# EasyEDA Pro project ZeptoWatch.eprj, board PCB5
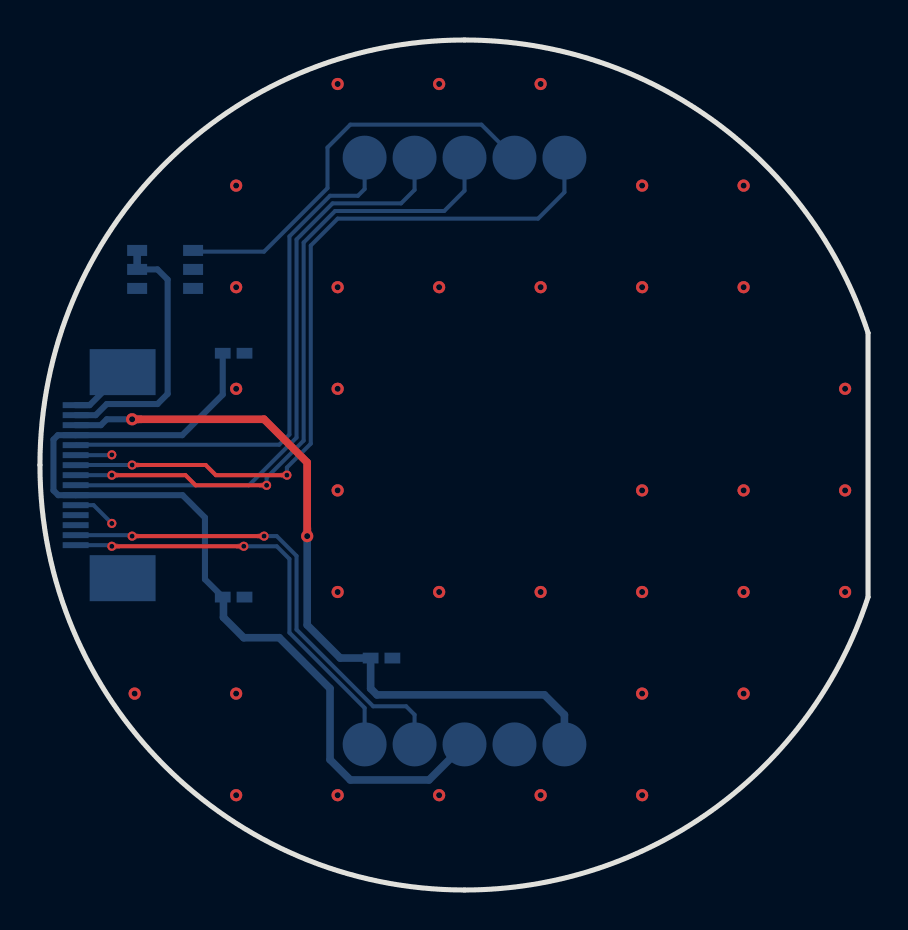
[diagram p14: board, top side]
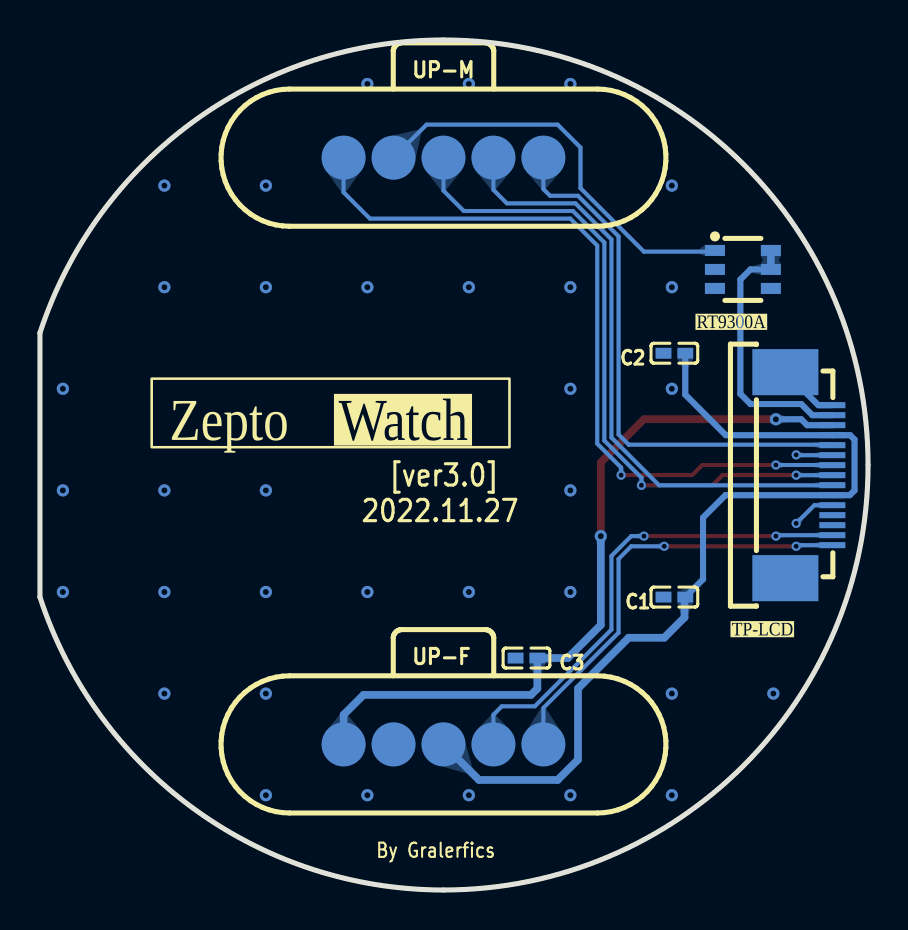
[diagram p15: board, bottom side, seen from below]

Outline 41.45 x 42.5 mm; copper layers: Top Layer, Bottom Layer. Coordinates in mm from the lower left corner of the outline.
Outline path: 0,21.25 arc(6.22,36.28) 21.25,42.5 arc(33.72,38.45) 41.45,27.86 41.45,14.64 arc(33.72,4.05) 21.25,0 arc(6.22,6.22) 0,21.25
Stack: Top Layer 0.035mm / Dielectric1 1.51mm FR4 er 4.5 / Bottom Layer 0.035mm

## Design rules (mm)
spacing safeClearance (default): track to track 0.152, other pairs 0 to 0.152
track width trackWidth (default): min 0.127, default 0.254, max 2.54
differential pair differentialPair (default): width min 0.127, default 0.254, max 2.54; gap min 0.152, default 0.152
via viaSize (default): diameter min 0.381, default 0.457, max 10; hole min 0.203, default 0.254, max 5.999

## Placement (name value [footprint] x y rotation side)
 RT9300A   -  [SOT-23-6_L2.9-W1.6-P0.95-LS2.8-BR]  6.26 31.03 0 bottom
 TP-LCD   -  [FFC-SMD_15P-P0.50_X05B20U15T]  2.96 20.74 270 bottom
C1  100nF  [C0402]  9.69 14.65 0 bottom
C2  100nF  [C0402]  9.69 26.84 0 bottom
C3  100nF  [C0402]  17.1 11.6 0 bottom
UP-F  -  [pogo-5pin-f]  21.25 7.28 0 bottom
UP-M  -  [pogo-5pin-m]  21.25 36.62 0 bottom

## Footprints (pads in the part's own frame, mm; a bottom-side part is the same pattern mirrored in y, then rotated)
C0402
  rect 0.79x0.54 smd: 1(-0.545,0) 2(0.545,0)
FFC-SMD_15P-P0.50_X05B20U15T
  rect 0.299x1.3 smd: 1(-3.5,1.176) 2(-2.999,1.176) 3(-2.499,1.176) 4(-1.999,1.176) 5(-1.501,1.176) 6(-1.001,1.176) 7(-0.5,1.176) 8(0,1.176) 9(0.5,1.176) 10(1.001,1.176) 11(1.501,1.176) 12(1.999,1.176) 13(2.499,1.176) 14(2.999,1.176) 15(3.5,1.176)
  rect 2.301x3.3 smd: 16(5.151,-1.176) 17(-5.151,-1.176)
pogo-5pin-f
  round 2.2 smd: 1(5,0) 2(2.5,0) 3(0,0) 4(-2.5,0) 5(-5,0)
pogo-5pin-m
  round 2.2 smd: 1(-5,0) 2(-2.5,0) 3(0,0) 4(2.5,0) 5(5,0)
SOT-23-6_L2.9-W1.6-P0.95-LS2.8-BR
  rect 1x0.55 smd: 1(1.4,-0.95) 2(1.4,0) 3(1.4,0.95) 4(-1.4,0.95) 5(-1.4,0) 6(-1.4,-0.95)

## Nets
GND:  RT9300A .2  TP-LCD .1  TP-LCD .6  TP-LCD .11  TP-LCD .16  TP-LCD .17 C1.2 C2.2 C3.2 UP-F.2
VBAT:  TP-LCD .3 C3.1 UP-F.1
VCC_3V3:  TP-LCD .4  TP-LCD .10 C1.1 C2.1 UP-F.3
LCD_BLK:  RT9300A .1 UP-M.4
LCD_DC:  TP-LCD .5 UP-M.1
LCD_LEDK:  RT9300A .5  RT9300A .6  TP-LCD .2
LCD_RST:  TP-LCD .9 UP-M.2
LCD_SCL:  TP-LCD .7 UP-M.5
LCD_SDA:  TP-LCD .8 UP-M.3
TP_SCL:  TP-LCD .15 UP-F.5
TP_SDA:  TP-LCD .14 UP-F.4

Pads without a net:  RT9300A  3 4;  TP-LCD  12 13

## Via types
v1: diameter 0.61, hole 0.305, Top Layer to Bottom Layer, 36 vias
v2: diameter 0.457, hole 0.254, Top Layer to Bottom Layer, 10 vias

## Routing (per net, layer and track width the routed paths; a pad name or vN(x,y) marks a point on that pad's centre or on a via; arc(x,y) is an arc through that point)
GND: length 7
  Bottom Layer w0.203: v2(3.6,21.76) 3.58,21.74 1.79,21.74 ; v2(3.6,18.33) 2.69,19.24  TP-LCD .11
  Bottom Layer w0.305:  TP-LCD .1 2.49,24.24  TP-LCD .17
  vias: v1(4.74,9.82) v1(9.82,35.22) v1(9.82,30.14) v1(9.82,25.06) v1(9.82,9.82) v1(9.82,4.74) v1(14.9,40.3) v1(14.9,30.14) v1(14.9,25.06) v1(14.9,19.98) v1(14.9,14.9) v1(14.9,4.74) v1(19.98,40.3) v1(19.98,30.14) v1(19.98,14.9) v1(19.98,4.74) v1(25.06,40.3) v1(25.06,30.14) v1(25.06,14.9) v1(25.06,4.74) v1(30.14,35.22) v1(30.14,30.14) v1(30.14,19.98) v1(30.14,14.9) v1(30.14,9.82) v1(30.14,4.74) v1(35.22,35.22) v1(35.22,30.14) v1(35.22,19.98) v1(35.22,14.9) v1(35.22,9.82) v1(40.3,25.06) v1(40.3,19.98) v1(40.3,14.9)
VBAT: length 37.8
  Top Layer w0.381: v1(13.38,17.69) 13.38,21.38 11.22,23.54 v1(4.61,23.54)
  Bottom Layer w0.305:  TP-LCD .3 3.05,23.24 3.34,23.54 v1(4.61,23.54)
  Bottom Layer w0.381: UP-F.1 26.25,8.76 25.25,9.76 16.87,9.76 16.55,10.07 16.55,11.6 15.03,11.6 13.38,13.25 v1(13.38,17.69)
VCC_3V3: length 45.8
  Bottom Layer w0.305: C2.1 9.15,24.77 7.12,22.74  TP-LCD .4 0.9,22.74 0.68,22.52 0.68,19.98 0.91,19.74  TP-LCD .10 7.14,19.74 8.26,18.62 8.26,15.53 C1.1
  Bottom Layer w0.381: UP-F.3 19.47,5.5 15.53,5.5 14.52,6.52 14.52,10.07 11.98,12.61 10.2,12.61 9.19,13.63 9.19,14.61 C1.1
LCD_BLK: length 20.6
  Bottom Layer w0.203: UP-M.4 22.1,38.27 15.53,38.27 14.39,37.12 14.39,35.09 11.22,31.92 7.72,31.92  RT9300A .1
LCD_DC: length 27.1
  Bottom Layer w0.203: UP-M.1 16.25,35.05 15.92,34.71 14.52,34.71 12.49,32.68 12.49,22.77 11.98,22.27 1.81,22.27 1.79,22.24
LCD_LEDK: length 13.4
  Bottom Layer w0.305:  TP-LCD .2 2.79,23.74 3.34,24.3 5.88,24.3 6.39,24.81 6.39,30.52 5.88,31.03  RT9300A .5
  Bottom Layer w0.381:  RT9300A .6  RT9300A .5
LCD_RST: length 30.5
  Bottom Layer w0.203:  TP-LCD .9 1.79,20.23 10.46,20.23 12.84,22.62 12.84,32.53 14.65,34.33 18.07,34.33 18.75,35.01 UP-M.2
LCD_SCL: length 38.3
  Top Layer w0.203: v2(4.61,21.25) 8.3,21.25 8.8,20.74 v2(12.36,20.74)
  Bottom Layer w0.203: v2(4.61,21.25) 1.79,21.25  TP-LCD .7 ; UP-M.5 26.25,34.89 24.93,33.57 14.9,33.57 13.55,32.22 13.55,22.32 12.36,21.12 v2(12.36,20.74)
LCD_SDA: length 33.5
  Top Layer w0.203: v2(11.34,20.23) 7.79,20.23 7.28,20.74 v2(3.6,20.74)
  Bottom Layer w0.203: UP-M.3 21.25,34.97 20.23,33.95 14.77,33.95 13.2,32.38 13.2,22.47 11.34,20.61 v2(11.34,20.23) ; v2(3.6,20.74)  TP-LCD .8
TP_SCL: length 21.8
  Top Layer w0.203: v2(10.2,17.19) v2(3.6,17.19)
  Bottom Layer w0.203: v2(10.2,17.19) 11.85,17.19 12.49,16.55 12.49,12.87 16.25,9.11 UP-F.5 ;  TP-LCD .15 3.54,17.24 v2(3.6,17.19)
TP_SDA: length 24.3
  Top Layer w0.203: v2(4.61,17.69) v2(11.22,17.69)
  Bottom Layer w0.203: v2(11.22,17.69) 11.85,17.69 12.84,16.7 12.84,13.02 16.68,9.19 18.33,9.19 18.75,8.76 UP-F.4 ; v2(4.61,17.69) 4.56,17.74  TP-LCD .14

## Copper pours and planes (outline as drawn; the poured copper is in the pictures)
GND on Top Layer: -0.34,42.84 42.84,42.84 42.84,-0.34 -0.34,-0.34
GND on Bottom Layer: -0.34,42.84 42.84,42.84 42.84,-0.34 -0.34,-0.34

Small or netless copper shapes (teardrops, artwork), in the pictures only: 10 on Top Layer, 38 on Bottom Layer

## Text on the board
Bottom Silkscreen Layer: By Gralerfics | [ver3.0] | 2022.11.27 | Watch | Zepto
